# Altium schematic sheet DACWaveyRadar.SchDoc: DAC WaveyRadar Schematic
size Letter; Author: Will Vu; CompanyName: Raccoon Wireless; DrawnBy: Will Vu, Raccoon Wireless; Engineer: Will Vu; Organization: Raccoon Wireless; DocumentNumber: 2-09; Revision: 2; SheetNumber: 9; SheetTotal: 15
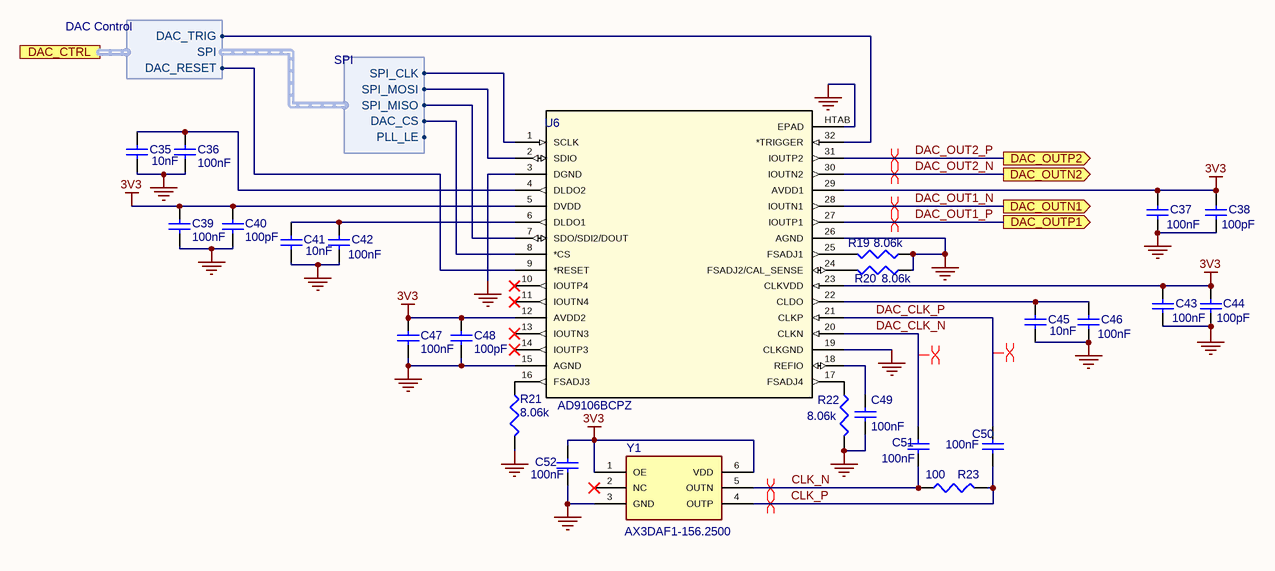
[diagram p0: DACWaveyRadar.SchDoc]

## Parts
C35  value 10nF  [CAPC0402(1005)60_L]  (hidden comment: Capacitor 10nF +/-20% 50V 0402)
C36  value 100nF  [CAPC0402(1005)60_L]  (hidden comment: Capacitor 100nF +/-20% 10V 0402)
C37  value 100nF  [CAPC0402(1005)60_L]  (hidden comment: Capacitor 100nF +/-20% 10V 0402)
C38  value 100pF  [CAPC1005X56X25LL10T15]  (hidden comment: 04023A101JAT2A)
C39  value 100nF  [CAPC0402(1005)60_L]  (hidden comment: Capacitor 100nF +/-20% 10V 0402)
C40  value 100pF  [CAPC1005X56X25LL10T15]  (hidden comment: 04023A101JAT2A)
C41  value 10nF  [CAPC0402(1005)60_L]  (hidden comment: Capacitor 10nF +/-20% 50V 0402)
C42  value 100nF  [CAPC0402(1005)60_L]  (hidden comment: Capacitor 100nF +/-20% 10V 0402)
C43  value 100nF  [CAPC0402(1005)60_L]  (hidden comment: Capacitor 100nF +/-20% 10V 0402)
C44  value 100pF  [CAPC1005X56X25LL10T15]  (hidden comment: 04023A101JAT2A)
C45  value 10nF  [CAPC0402(1005)60_L]  (hidden comment: Capacitor 10nF +/-20% 50V 0402)
C46  value 100nF  [CAPC0402(1005)60_L]  (hidden comment: Capacitor 100nF +/-20% 10V 0402)
C47  value 100nF  [CAPC0402(1005)60_L]  (hidden comment: Capacitor 100nF +/-20% 10V 0402)
C48  value 100pF  [CAPC1005X56X25LL10T15]  (hidden comment: 04023A101JAT2A)
C49  value 100nF  [CAPC0402(1005)60_L]  (hidden comment: Capacitor 100nF +/-20% 10V 0402)
C50  value 100nF  [CAPC0402(1005)60_L]  (hidden comment: Capacitor 100nF +/-20% 10V 0402)
C51  value 100nF  [CAPC0402(1005)60_L]  (hidden comment: Capacitor 100nF +/-20% 10V 0402)
C52  value 100nF  [CAPC0402(1005)60_L]  (hidden comment: Capacitor 100nF +/-20% 10V 0402)
R19  value 8.06k  [RESC1005X40X25ML05T05]  (hidden comment: CRCW04028K06FKED)
R20  value 8.06k  [RESC1005X40X25ML05T05]  (hidden comment: CRCW04028K06FKED)
R21  value 8.06k  [RESC1005X40X25ML05T05]  (hidden comment: CRCW04028K06FKED)
R22  value 8.06k  [RESC1005X40X25ML05T05]  (hidden comment: CRCW04028K06FKED)
R23  value 100  [RESC0402(1005)_L]  (hidden comment: Resistor 100R +/-1 % 0402 63 mW)
U6  AD9106BCPZ  [CP_32_12_ADI]
Y1  AX3DAF1-156.2500  [AX3DAF1]

## Ports
DAC_CTRL (harness DAC Control), DAC_OUTN1 (out), DAC_OUTN2 (out), DAC_OUTP1 (out), DAC_OUTP2 (out)

## Harnesses
SPI: SPI_MOSI, SPI_CLK, PLL_LE, SPI_MISO, DAC_CS
DAC Control: SPI, DAC_RESET, DAC_TRIG

## Nets
3V3: C37.2 C38.2 C39.1 C40.1 C43.2 C44.2 C47.1 C48.1 C52.1 U6.5(DVDD) U6.12(AVDD2) U6.23(CLKVDD) U6.29(AVDD1) Y1.1(OE) Y1.6(VDD)
GND: C35.2 C36.1 C37.1 C38.1 C39.2 C40.2 C41.2 C42.1 C43.1 C44.1 C45.2 C46.1 C47.2 C48.2 C49.2 C52.2 R19.1 R20.1 R21.2 R22.2 U6.3(DGND) U6.15(AGND) U6.19(CLKGND) U6.26(AGND) U6.HTAB(EPAD) Y1.3(GND)
CLK_N: C51.2 R23.1 Y1.5(OUTN)
CLK_P: C50.2 R23.2 Y1.4(OUTP)
DAC_CLK_N: C51.1 U6.20(CLKN)
DAC_CLK_P: C50.1 U6.21(CLKP)
DAC_OUT1_N: U6.28(IOUTN1) ; port DAC_OUTN1
DAC_OUT1_P: U6.27(IOUTP1) ; port DAC_OUTP1
DAC_OUT2_N: U6.30(IOUTN2) ; port DAC_OUTN2
DAC_OUT2_P: U6.31(IOUTP2) ; port DAC_OUTP2
NetC35_1: C35.1 C36.2 U6.4(DLDO2)
NetC41_1: C41.1 C42.2 U6.6(DLDO1)
NetC45_1: C45.1 C46.2 U6.22(CLDO)
NetC49_1: C49.1 U6.18(REFIO)
NetR19_2: R19.2 U6.25(FSADJ1)
NetR20_2: R20.2 U6.24(FSADJ2/CAL_SENSE)
NetR21_1: R21.1 U6.16(FSADJ3)
NetR22_1: R22.1 U6.17(FSADJ4)
NetU6_1: U6.1(SCLK) ; harness SPI.SPI_CLK
NetU6_2: U6.2(SDIO) ; harness SPI.SPI_MOSI
NetU6_7: U6.7(SDO/SDI2/DOUT) ; harness SPI.SPI_MISO
NetU6_8: U6.8(*CS) ; harness SPI.DAC_CS
NetU6_9: U6.9(*RESET) ; port DAC_CTRL.DAC_RESET
NetU6_32: U6.32(*TRIGGER) ; port DAC_CTRL.DAC_TRIG

Not connected (* = marked no-connect by the designer): U6 10(IOUTP4)* 11(IOUTN4)* 13(IOUTN3)* 14(IOUTP3)*; Y1 2(NC)*

## Layout directives
differential pair: CLK_N, CLK_P, DAC_CLK_N, DAC_CLK_P, DAC_OUT1_N, DAC_OUT1_P, DAC_OUT2_N, DAC_OUT2_P

## Notes on the sheet
- /

## Library data of the parts
C35 C41 C45 = CMP-001-00069-4: Chip Capacitor, 10nF +/-20%, 50V, 0402, Thickness 0.6 mm; Tolerance: 5%; Max Operating Temperature: 85°C; Voltage Rating: 50V; Case/Package: 0402; Pins: 2; Min Operating Temperature: -55°C; Mounting Technology: SMT
C36 C37 C39 C42 C43 C46 C47 C49-C52 = CMP-001-00061-4: Chip Capacitor, 100nF +/-20%, 10V, 0402, Thickness 0.6 mm; Tolerance: 20%; Case/Package: 0402; Voltage Rating: 10V; Pins: 2; Mounting Technology: SMT; Max Operating Temperature: 85°C; Min Operating Temperature: -55°C
C38 C40 C44 C48 = CMP-001-00083-2: AVX - 04023A101JAT2A - SMD Multilayer Ceramic Capacitor, 100 pF, 25 V, 0402 [1005 Metric], ± 5%, C0G / NP0, AVX 0402 MLCC
R19-R22 = CMP-009-00189-1: Res Thick Film 0402 8.06K Ohm 1% 0.063W(1/16W) ±100ppm/C Molded SMD Automotive Paper T/R
R23 = CMP-009-00167-4: Chip Resistor, 100 Ohms, +/-1 %, 63 mW, -55 to 155 degC, 0402; Power: 63mW; Tolerance: 1%; Pins: 2; Min Operating Temperature: -55°C; Case/Package: 0402; Max Operating Temperature: 155°C
U6 = CMP-014-000000-5: No Description Available; Vendor: Analog Devices Inc; SourceLibrary: Analog_2015-01-06; Built_By: EMA_UL_Team; Design Item ID: AD9106BCPZ; Type: DEV; Copyright: Copyright (C) 2018 Accelerated Designs. All rights reserved; RefDes: RefDes; Source: 2021-05-30_21-42-50.SchLib; Manufacturer_Part_Number: AD9106BCPZ
Y1 = CMP-017-000000-3: Oscillator XO 156.25MHz ±50ppm LVDS 55% 3.3V 6-Pin SMD Bulk; Manufacturer_Name: ABRACON; Height: 1.1mm; Datasheet Link: https://abracon.com/datasheets/AX3.pdf; Source: SamacSys.SchLib; Manufacturer_Part_Number: AX3DAF1-156.2500; Value: 156.25MHz; Design Item ID: AX3DAF1-156.2500